# Altium schematic sheet ControlUnit.SchDoc
size A4; SheetNumber: 3; SheetTotal: 15
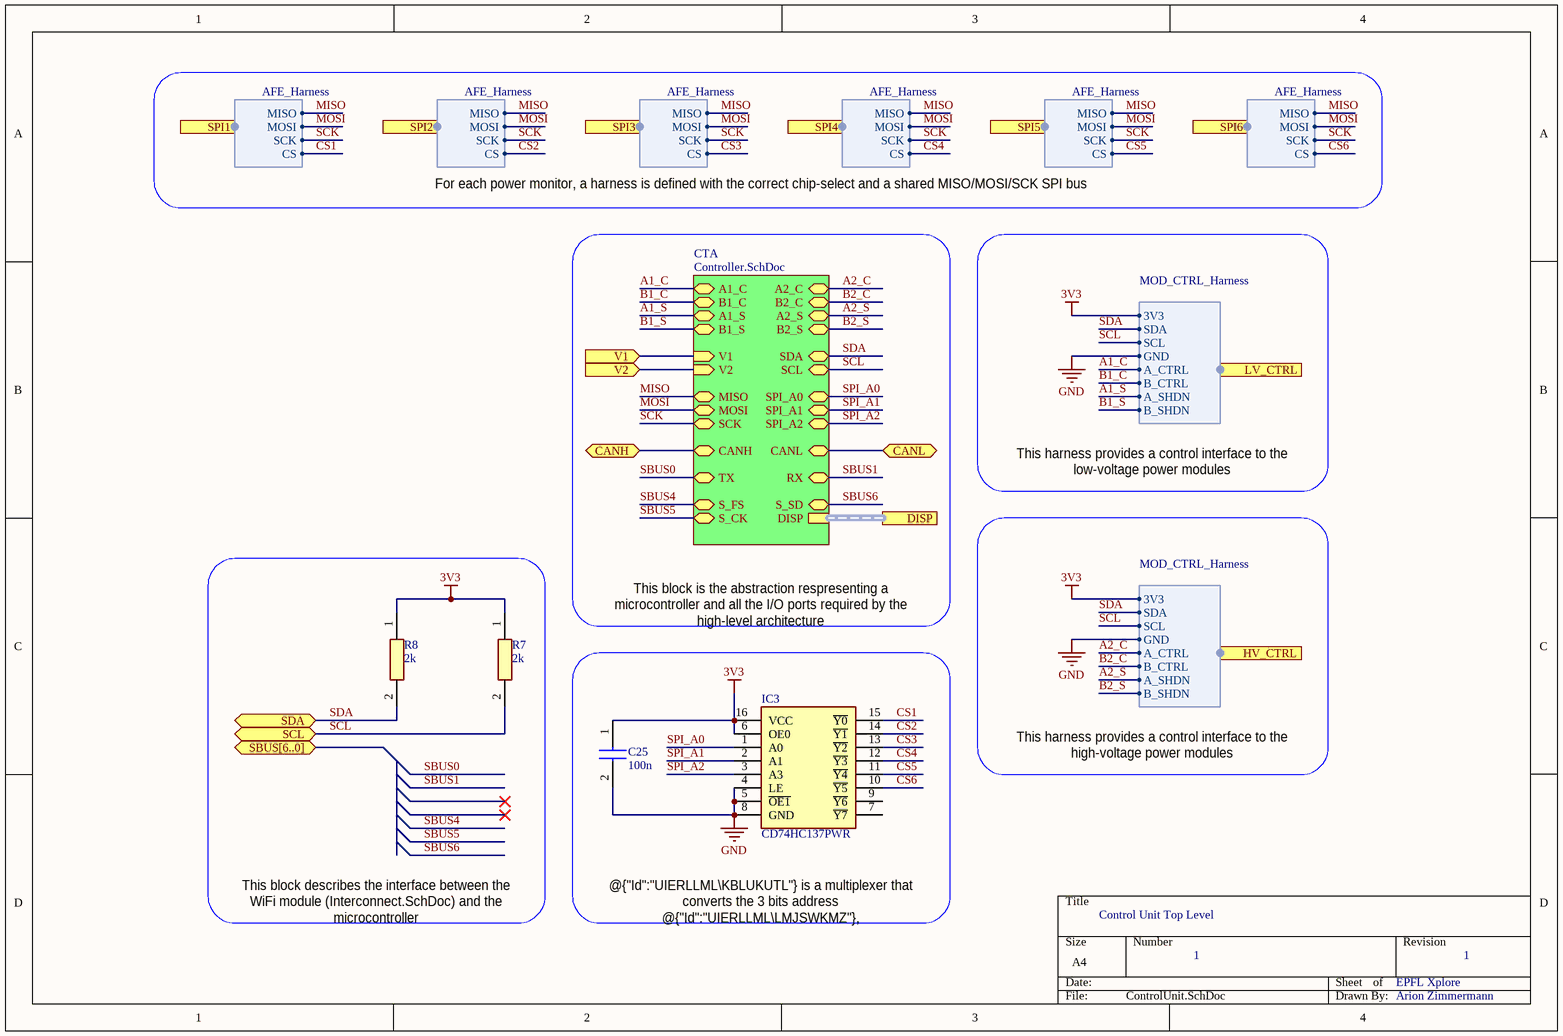
[diagram p0: ControlUnit.SchDoc]

## Parts
C25  value 100n  [CAPC1608X95N]  (hidden comment: C0603C104K5RACTU)
IC3  CD74HC137PWR  [SOP65P640X120-16N]
R7  value 2k  [RESC1608X50N]  (hidden comment: CRCW06032K00JNEB)
R8  value 2k  [RESC1608X50N]  (hidden comment: CRCW06032K00JNEB)

## Sub-sheets
CTA = Controller.SchDoc: V1 (in), V2 (in), SCL (bidir), SDA (bidir), B2_S (bidir), A2_S (bidir), B2_C (bidir), A2_C (bidir), RX (bidir), TX (bidir), MISO (bidir), MOSI (bidir), SCK (bidir), SPI_A1 (bidir), SPI_A2 (bidir), SPI_A0 (bidir), CANH (bidir), CANL (bidir), S_FS (bidir), S_CK (bidir), S_SD (bidir), B1_S (bidir), A1_S (bidir), B1_C (bidir), A1_C (bidir), DISP (harness DISP_Harness)

## Ports
CANH (bidir), CANL (bidir), DISP (harness DISP_Harness), HV_CTRL (harness MOD_CTRL_Harness), LV_CTRL (harness MOD_CTRL_Harness), SBUS[6..0] (bidir), SCL (bidir), SDA (bidir), SPI1 (harness AFE_Harness), SPI2 (harness AFE_Harness), SPI3 (harness AFE_Harness), SPI4 (harness AFE_Harness), SPI5 (harness AFE_Harness), SPI6 (harness AFE_Harness), V1 (in), V2 (in)

## Harnesses
AFE_Harness: MISO, MOSI, SCK, CS
MOD_CTRL_Harness: B_SHDN, A_SHDN, B_CTRL, A_CTRL, GND, SCL, SDA, 3V3

## Nets
3V3: C25.1 IC3.6(OE0) IC3.16(VCC) R7.1 R8.1 ; port LV_CTRL.3V3, port HV_CTRL.3V3
GND: C25.2 IC3.4(LE) IC3.5(~{OE1}) IC3.8(GND) ; port LV_CTRL.GND, port HV_CTRL.GND
A1_C: sheet CTA/A1_C, port LV_CTRL.A_CTRL
A1_S: sheet CTA/A1_S, port LV_CTRL.A_SHDN
A2_C: sheet CTA/A2_C, port HV_CTRL.A_CTRL
A2_S: sheet CTA/A2_S, port HV_CTRL.A_SHDN
B1_C: sheet CTA/B1_C, port LV_CTRL.B_CTRL
B1_S: sheet CTA/B1_S, port LV_CTRL.B_SHDN
B2_C: sheet CTA/B2_C, port HV_CTRL.B_CTRL
B2_S: sheet CTA/B2_S, port HV_CTRL.B_SHDN
CANH: port CANH, sheet CTA/CANH
CANL: port CANL, sheet CTA/CANL
CS1: IC3.15(~{Y0}) ; port SPI1.CS
CS2: IC3.14(~{Y1}) ; port SPI2.CS
CS3: IC3.13(~{Y2}) ; port SPI3.CS
CS4: IC3.12(~{Y3}) ; port SPI4.CS
CS5: IC3.11(~{Y4}) ; port SPI5.CS
CS6: IC3.10(~{Y5}) ; port SPI6.CS
MISO: sheet CTA/MISO, port SPI1.MISO, port SPI2.MISO, port SPI3.MISO, port SPI4.MISO, port SPI5.MISO, port SPI6.MISO
MOSI: sheet CTA/MOSI, port SPI1.MOSI, port SPI2.MOSI, port SPI3.MOSI, port SPI4.MOSI, port SPI5.MOSI, port SPI6.MOSI
SBUS0: sheet CTA/TX
SBUS1: sheet CTA/RX
SBUS4: sheet CTA/S_FS
SBUS5: sheet CTA/S_CK
SBUS6: sheet CTA/S_SD
SCK: sheet CTA/SCK, port SPI1.SCK, port SPI2.SCK, port SPI3.SCK, port SPI4.SCK, port SPI5.SCK, port SPI6.SCK
SCL: R7.2 ; port SCL, sheet CTA/SCL, port LV_CTRL.SCL, port HV_CTRL.SCL
SDA: R8.2 ; port SDA, sheet CTA/SDA, port LV_CTRL.SDA, port HV_CTRL.SDA
SPI_A0: IC3.1(A0) ; sheet CTA/SPI_A0
SPI_A1: IC3.2(A1) ; sheet CTA/SPI_A1
SPI_A2: IC3.3(A3) ; sheet CTA/SPI_A2
V1: port V1, sheet CTA/V1
V2: port V2, sheet CTA/V2

Not connected (* = marked no-connect by the designer): IC3 7(~{Y7}) 9(~{Y6})

## Buses and harness runs
harness port DISP = sheet CTA/DISP

## Notes on the sheet
- For each power monitor, a harness is defined with the correct chip-select and a shared MISO/MOSI/SCK SPI bus
- This harness provides a control interface to the low-voltage power modules
- This block is the abstraction respresenting a microcontroller and all the I/O ports required by the high-level architecture
- This harness provides a control interface to the high-voltage power modules
- This block describes the interface between the WiFi module (Interconnect.SchDoc) and the microcontroller
- @{"Id":"UIERLLML\KBLUKUTL"} is a multiplexer that converts the 3 bits address @{"Id":"UIERLLML\LMJSWKMZ"}, @{"Id":"UIERLLML\LQKXKBVL"}, @{"Id":"UIERLLML\IKBLSFXQ"} to a chip-select signal for the power monitors
- Control Unit Top Level
- 1
- EPFL Xplore
- Arion Zimmermann

## Library data of the parts
C25 = C0603C104K5RACTU: Capacitor; Manufacturer_Name: Kemet; Datasheet Link: http://www.farnell.com/datasheets/2205446.pdf; Height: 0.95mm; Manufacturer_Part_Number: C0603C104K5RACTU; Mouser Part Number: 80-C0603C104K5R; Mouser Price/Stock: https://www.mouser.co.uk/ProductDetail/KEMET/C0603C104K5RACTU?qs=l5k%252BbMnNDkkVcnZPSAaaiQ%3D%3D; Arrow Part Number: C0603C104K5RACTU; Arrow Price/Stock: https://www.arrow.com/en/products/c0603c104k5ractu/kemet-corporation; Supplier 1: Mouser; Supplier Part Number 1: 80-C0603C104K5R
IC3 = CD74HC137PWR: Integrated Circuit; Manufacturer_Name: Texas Instruments; Datasheet Link: http://www.ti.com/lit/gpn/cd74hc137; Height: 1.2mm; Manufacturer_Part_Number: CD74HC137PWR; Mouser Part Number: 595-CD74HC137PWR; Mouser Price/Stock: https://www.mouser.co.uk/ProductDetail/Texas-Instruments/CD74HC137PWR/?qs=YxwvVplHM%2Fm8ZkoHTCdntQ%3D%3D; Arrow Part Number: CD74HC137PWR; Arrow Price/Stock: https://www.arrow.com/en/products/cd74hc137pwr/texas-instruments; Supplier 1: Mouser; Supplier Part Number 1: 595-CD74HC137PWR
R7 R8 = CRCW0603931RFKEA: Resistor; Manufacturer_Name: Vishay; Manufacturer_Part_Number: CRCW0603787RFKEA; Datasheet Link: http://www.vishay.com/docs/20035/dcrcwe3.pdf; Height: 0.5mm; Supplier 1: Mouser; Supplier Part Number 1: 71-CRCW06032K00JNEB